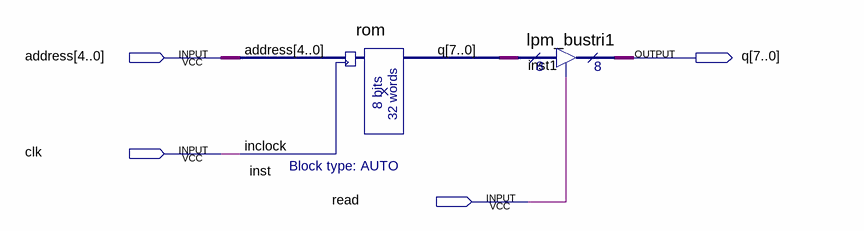
[diagram p0: schematic sheet]
// Quartus schematic rom0.bdf as structural Verilog: 2 symbols, 4 pins
module rom0 (
  input  [4:0] address,
  input  clk,
  input  read,
  output [7:0] q
);

  wire [7:0] inst_q;

  rom inst (.address(address), .inclock(clk), .q(inst_q));
  lpm_bustri1 inst1 (.enabledt(read), .data(inst_q), .tridata(q));
endmodule
